# EAGLE design max1k (EAGLE 7.2.0)
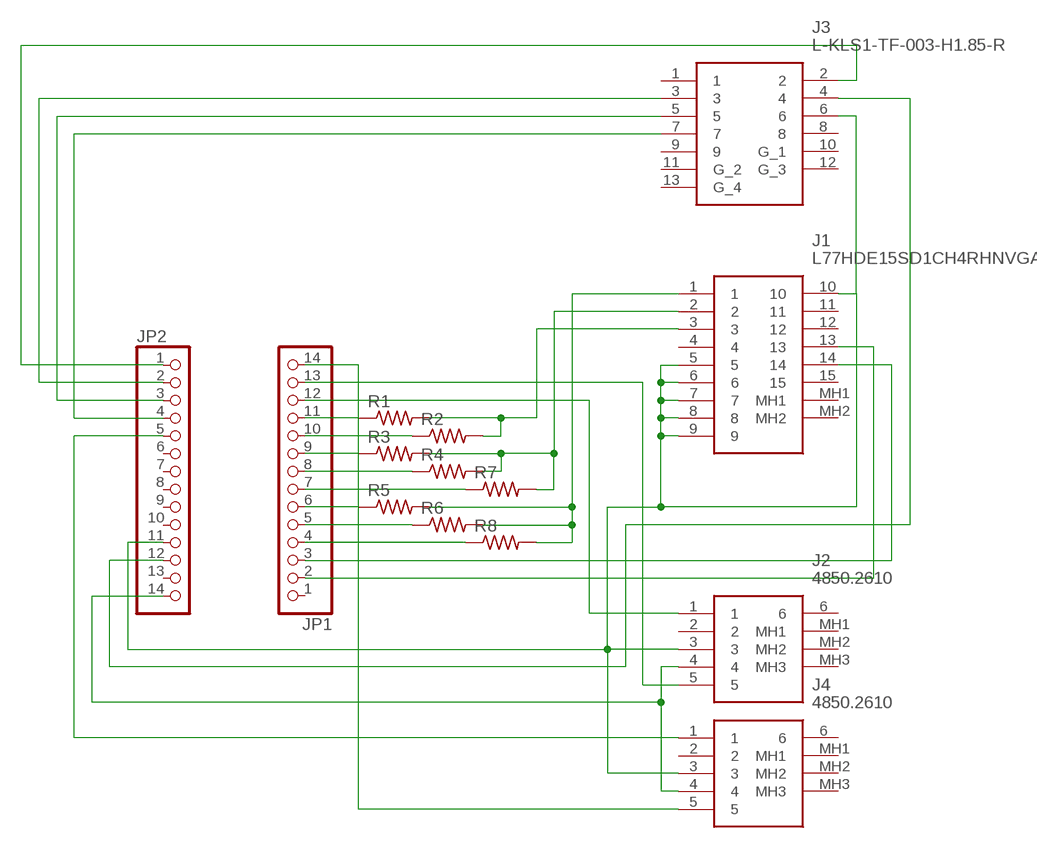
[diagram p0: schematic, sheet 1]

## Parts
J1  L77HDE15SD1CH4RHNVGA  [L77HDE15SD1CH4RHNVGA]
J2  4850.2610  [48502610]
J3  L-KLS1-TF-003-H1.85-R  [L-KLS1-TF-003-H1.85-R]
J4  4850.2610  [48502610]
JP1  PINHD-1X14-CB  [1X14-CB]
JP2  PINHD-1X14-CB  [1X14-CB]
R1  R-US_R0805  [R0805]
R2  R-US_R0805  [R0805]
R3  R-US_R0805  [R0805]
R4  R-US_R0805  [R0805]
R5  R-US_R0805  [R0805]
R6  R-US_R0805  [R0805]
R7  R-US_R0805  [R0805]
R8  R-US_R0805  [R0805]

## Nets
GND: J1.5 J1.6 J1.7 J1.8 J1.9 J1.10 J2.3 J3.6 J4.3 JP2.11
N$1: J1.13 JP1.2
N$2: J1.14 JP1.3
N$3: JP1.11 R1.1
N$4: JP1.10 R2.1
N$5: JP1.9 R3.1
N$6: JP1.8 R4.1
N$7: JP1.7 R7.1
N$8: JP1.6 R5.1
N$9: JP1.5 R6.1
N$10: JP1.4 R8.1
N$11: J1.3 R1.2 R2.2
N$12: J1.2 R3.2 R4.2 R7.2
N$13: J1.1 R5.2 R6.2 R8.2
N$14: J3.4 JP2.12
N$15: J4.5 JP1.14
N$16: J2.1 JP1.12
N$17: J3.5 JP2.3
N$18: J3.3 JP2.2
N$19: J4.1 JP2.5
N$20: J3.7 JP2.4
N$21: J2.5 JP1.13
N$23: J2.4 J4.4 JP2.14
N$24: J3.2 JP2.1
Unconnected: J1.4 J1.11 J1.12 J1.15 J1.MH1 J1.MH2 J2.2 J2.6 J2.MH1 J2.MH2 J2.MH3 J3.1 J3.8 J3.9 J3.10(G_1) J3.11(G_2) J3.12(G_3) J3.13(G_4) J4.2 J4.6 J4.MH1 J4.MH2 J4.MH3 JP1.1 JP2.6 JP2.7 JP2.8 JP2.9 JP2.10 JP2.13

## Library data of the parts
J1 = dsub15_2.00_L77HDE15SD1CH4RHNVGA:L77HDE15SD1CH4RHNVGA: D-Sub High Density Connectors Dsub, Stamped Signal 3A, High Density, Right Angle PCB Thru Hole, FP=8.89mm (.350"), 15 Socket, Bright Tin Shell, Flash Gold, 4-40 Rear Insert, Ground Tab with Boardlock, High Temp, Nickel Shell, VGA Source: Datasheet <https://componentsearchengine.com/Datasheets/1/L77HDE15SD1CH4RHNVGA.pdf>; DESCRIPTION: D-Sub High Density Connectors Dsub, Stamped Signal 3A, High Density, Right Angle PCB Thru Hole, FP=8.89mm (.350"), 15 Socket, Bright Tin Shell, Flash Gold, 4-40 Rear Insert, Ground Tab with Boardlock, High Temp, Nickel Shell, VGA; HEIGHT: 12.55mm; MANUFACTURER_NAME: Amphenol; MANUFACTURER_PART_NUMBER: L77HDE15SD1CH4RHNVGA; MOUSER_PART_NUMBER: 523-7HDE15SDH4RHNVGA; MOUSER_PRICE-STOCK: https://www.mouser.co.uk/ProductDetail/Amphenol-Commercial-Products/L77HDE15SD1CH4RHNVGA?qs=f9yNj16SXrKPVxRw%2FcVQYg%3D%3D
J2 J4 = mini_din_4850.2610:4850.2610: SCHURTER - 4850.2610 - RECEPTACLE, MINI-DIN, PCB, THT, RA, 6WAY Source: Datasheet <http://www.schurterinc.com/bundles/snceschurter/epim/_ProdPool_/newDS/en/typ_4850.2610.pdf>; ALLIED_NUMBER: 70597687; ALLIED_PRICE-STOCK: https://www.alliedelec.com/schurter-4850-2610/70597687/; DESCRIPTION: SCHURTER - 4850.2610 - RECEPTACLE, MINI-DIN, PCB, THT, RA, 6WAY; HEIGHT: 12mm; MANUFACTURER_NAME: SCHURTER; MANUFACTURER_PART_NUMBER: 4850.2610; MOUSER_PART_NUMBER: 693-4850.2610; MOUSER_PRICE-STOCK: https://www.mouser.com/Search/Refine.aspx?Keyword=693-4850.2610
J3 = L-KLS1-TF-003-H1.85-R:L-KLS1-TF-003-H1.85-R: Micro SD Card Connector Source: Datasheet <https://img.ozdisan.com/ETicaret_Dosya/476392_7149645.pdf>; DESCRIPTION: Micro SD Card Connector; HEIGHT: mm; MANUFACTURER_NAME: KLS Electronic; MANUFACTURER_PART_NUMBER: L-KLS1-TF-003-H1.85-R
JP1 JP2 = adafruit:PINHD-1X14: PIN HEADER
R1-R8 = adafruit:R-US_: RESISTOR, American symbol

## Net classes
0 default: width 0.3 mm, drill 0.6 mm, clearance 0.2 mm

## Board
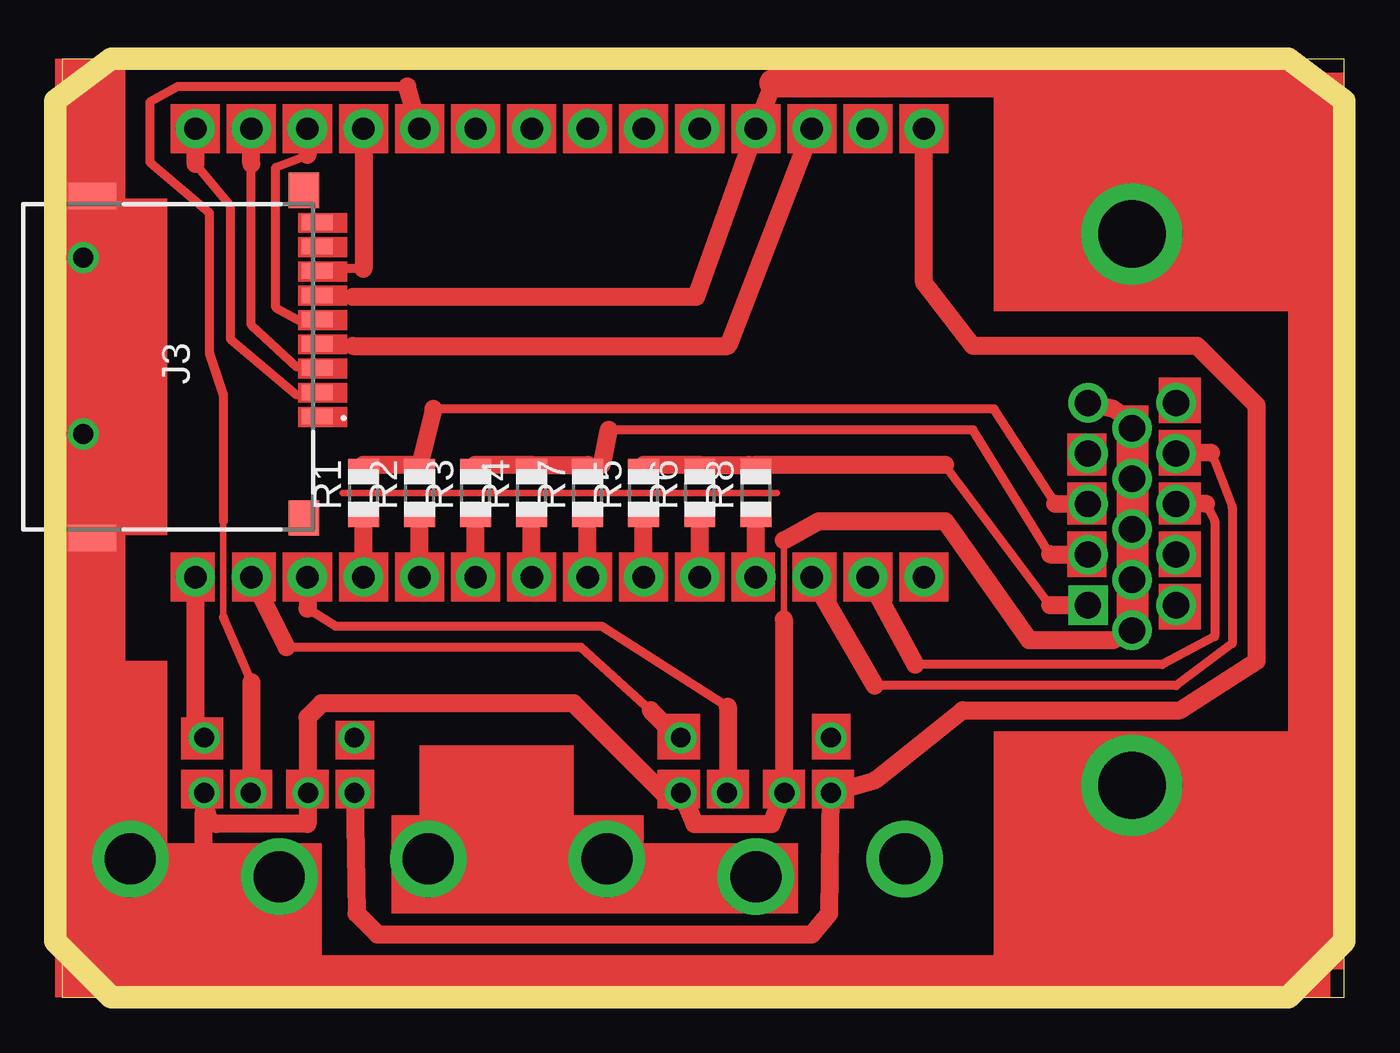
[diagram p1: board, top side]
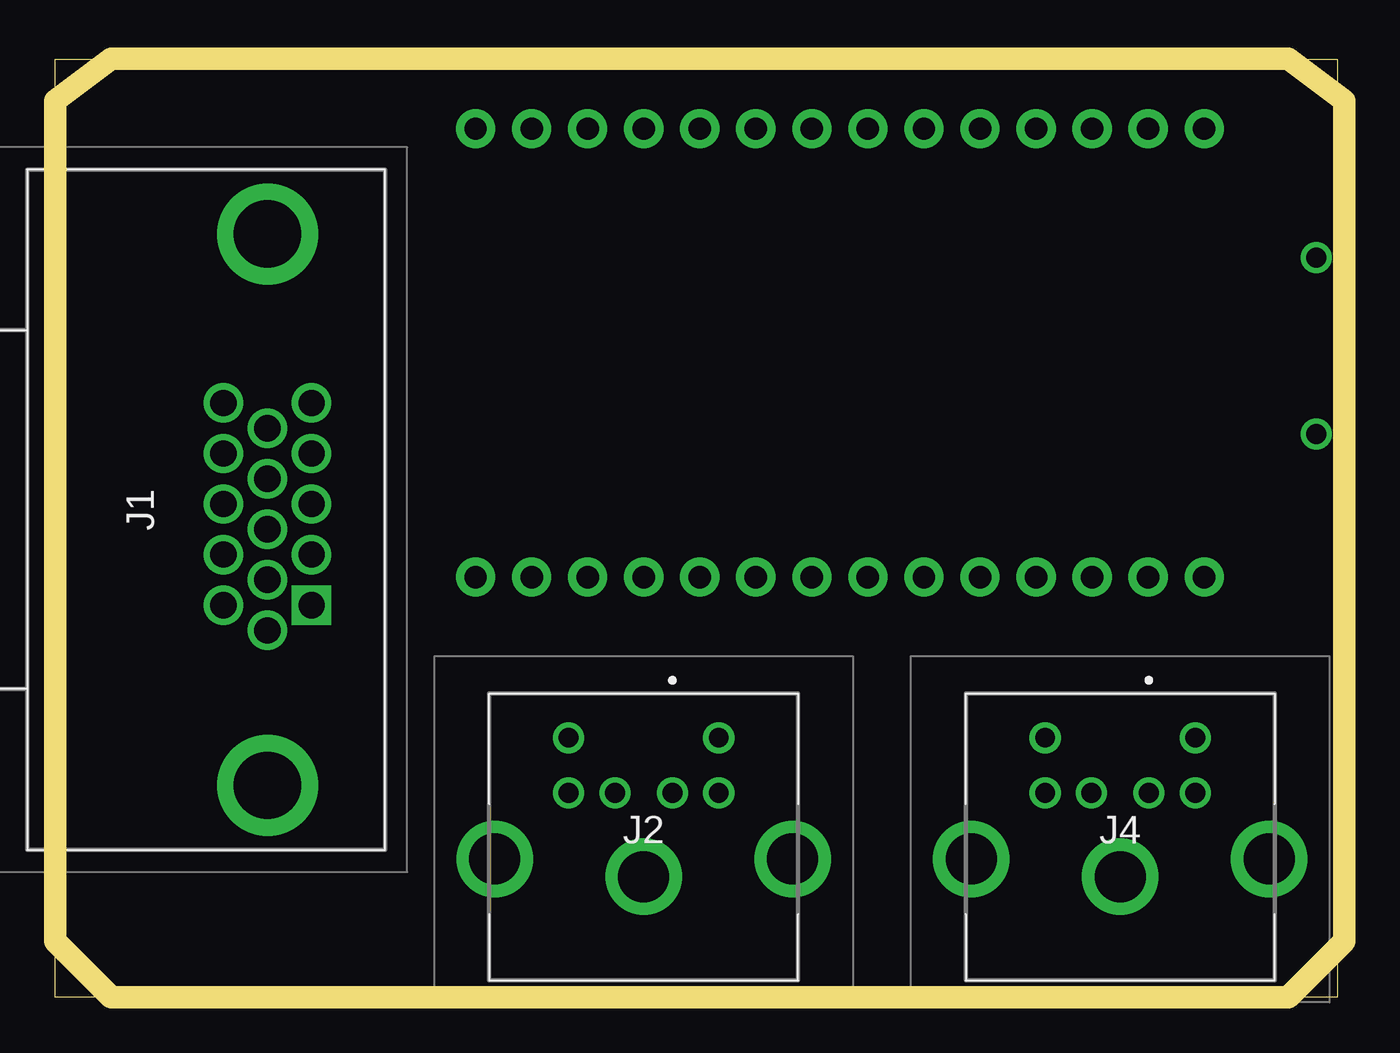
[diagram p2: board, bottom side, seen from below]

Size 58.09 x 42.52 mm. Coordinates in mm from the lower left corner, seen from the top.
Outline: 58.09,0 58.09,42.52 0,42.52 0,0 58.09,0
Copper layers (1*16): Top 0.035mm / dielectric 1.5mm / Bottom 0.035mm
Design rules "default": minimum track width 10mil, minimum drill 24mil, track to track 8mil, track to pad 8mil, pad to pad 8mil, via to via 8mil, smd to smd 8mil, copper to edge 40mil, drill to drill 8mil, minimum pad ring 10mil, minimum via ring 8mil, stop-mask expansion 4mil, vias tented up to drill 0mil, thermal gap 10mil
Milling: 8 lines

### Footprints (pad centres in the part's own frame; a part is rotated, then mirrored left to right if it is on the bottom)
L77HDE15SD1CH4RHNVGA = drill 1.19 pad 1.785 square: 1 0,4 | drill 1.19 pad 1.785: 2 -2.29,4; 3 -4.58,4; 4 -6.87,4; 5 -9.16,4; 6 1.145,2; 7 -1.145,2; 8 -3.435,2; 9 -5.725,2; 10 -8.015,2; 11 0,0; 12 -2.29,0; 13 -4.58,0; 14 -6.87,0; 15 -9.16,0 | drill 3.05 pad 4.575: MH1 8.17,2; MH2 -16.82,2
48502610 = drill 0.9 pad 1.4: 1 1.3,1.65; 2 -1.3,1.65; 3 3.4,1.65; 4 -3.4,1.65; 5 3.4,4.15; 6 -3.4,4.15 | drill 2.309 pad 3.463: MH1 -6.75,-1.35; MH2 6.75,-1.35; MH3 0,-2.15
L-KLS1-TF-003-H1.85-R = smd 0.7 x 1.4: 1 2.25,10.6; 2 1.15,10.6; 3 0.05,10.6; 4 -1.05,10.6; 5 -2.15,10.6; 6 -3.25,10.6; 7 -4.35,10.6; 8 -5.45,10.6; 9 -6.55,10.6 | smd 1.6 x 1.4: 10 -8,10; 13 6.85,10 | smd 1.2 x 2.2: 11 -7.75,0.4; 12 7.75,0.4 | drill 0.9 pad 1.4: 14 3.05,0; 15 -4.95,0
1X14-CB = drill 1.016 pad 1.778: 1 -16.51,0; 2 -13.97,0; 3 -11.43,0; 4 -8.89,0; 5 -6.35,0; 6 -3.81,0; 7 -1.27,0; 8 1.27,0; 9 3.81,0; 10 6.35,0; 11 8.89,0; 12 11.43,0; 13 13.97,0; 14 16.51,0
R0805 = smd 1.1 x 1.4: 1 -1,0; 2 1,0

### Placement (x,y rotation side)
J1  50.47,17.78 270 bottom
J2  31.42,7.62 0 bottom
J3  0.94,28.57 270 top
J4  9.83,7.62 0 bottom
JP1  22.53,19.05 180 top
JP2  22.53,39.37 0 top
R1  13.64,22.86 90 top
R2  16.18,22.86 90 top
R3  18.72,22.86 90 top
R4  21.26,22.86 90 top
R5  26.34,22.86 90 top
R6  28.88,22.86 90 top
R7  23.8,22.86 90 top
R8  31.42,22.86 90 top

### Tracks (layer width: path | path; a pad name or v marks a point on that pad's centre or on a via)
GND
  Top 0.3: 6.97,7.86 6.66,8.89 J4.3 6.02,9.52 | 48.57,17.14 J1.6 | 48.57,18.41 J1.7 48.57,19.05 | 48.57,20.95 J1.8 48.57,21.59 | 48.57,23.5 J1.9 | 46.03,27.3 J1.5
  Top 0.305: 32.69,20.72 32.69,17.14
  Top 0.406: 13.16,31.75 J3.6
  Top 0.813: 6.97,7.86 11.1,7.86 11.1,12.7 11.74,13.34 23.17,13.34 27.61,8.89 J2.3 28.64,7.86 32.13,7.86 32.69,9.21 32.69,17.14 | 48.57,18.41 48.57,17.14 | 48.57,19.05 48.57,20.95 | J1.9 48.57,24.13 48.57,25.4 J1.10 48.57,26.04 47.61,26.67 J1.5 | 48.57,23.5 48.57,21.59 | 32.69,20.72 34.28,21.59 39.99,21.59 43.8,16.19 47.61,16.19 J1.6 | 32.21,41.43 JP2.11 28.72,31.75 13.16,31.75 | 55.39,41.43 57.14,40.01 57.14,3.49 55.23,0.95 6.97,1.27 6.34,2.54 J4.3
  Top 1.27: 32.21,41.43 55.39,41.43
N$1
  Top 0.406: 38.64,15.08 49.84,15.08 52.22,16.35 52.22,21.59 51.82,22.38
  Top 0.813: 38.64,15.08 JP1.2 | 51.82,22.38 J1.13
N$2
  Top 0.406: 36.82,14.13 50.47,14.13 53.01,16.03 53.01,22.23 52.06,24.69
  Top 0.813: 36.82,14.13 JP1.3 | 52.06,24.69 J1.14
N$3
  Top 0.813: JP1.11 R1.1
N$4
  Top 0.813: JP1.10 R2.1
N$5
  Top 0.813: JP1.9 R3.1
N$6
  Top 0.813: JP1.8 R4.1
N$7
  Top 0.813: JP1.7 R7.1
N$8
  Top 0.813: JP1.6 R5.1
N$9
  Top 0.813: JP1.5 R6.1
N$10
  Top 0.813: JP1.4 R8.1
N$11
  Top 0.3: 13.64,24.13 R1.2 | 16.18,24.13 R2.2
  Top 0.406: 16.82,26.67 42.22,26.67 44.99,22.38
  Top 0.813: 13.64,24.13 16.18,24.13 16.82,26.67 | 44.99,22.38 J1.3
N$12
  Top 0.3: 18.72,24.13 R3.2 | 21.26,24.13 R4.2 | 24.44,24.13 23.8,24.13 R7.2
  Top 0.406: 24.75,25.72 41.26,25.72 44.76,20.08
  Top 0.813: 18.72,24.13 21.26,24.13 23.8,24.13 | 24.75,25.72 24.44,24.13 | 44.76,20.08 J1.2
N$13
  Top 0.3: 26.34,24.13 R5.2 | 31.42,24.13 R8.2 31.1,24.13 | 28.88,24.13 R6.2
  Top 0.406: 44.76,17.78 39.99,24.13
  Top 0.813: 26.34,24.13 28.88,24.13 31.1,24.13 31.42,24.13 39.99,24.13 | 44.76,17.78 J1.1
N$14
  Top 0.406: 13.16,29.53 J3.4
  Top 0.813: JP2.12 30.15,29.53 13.16,29.53
N$15
  Top 0.813: JP1.14 6.02,12.07 J4.5
N$16
  Top 0.406: 30.15,13.18 24.44,16.83 12.37,16.83 11.1,17.62
  Top 0.813: 30.15,13.18 30.15,9.84 J2.1 | JP1.12 11.1,17.62
N$17
  Top 0.3: 11.1,30.48 J3.5
  Top 0.406: 11.1,30.48 9.67,31.27 9.67,37.62 11.1,38.18
  Top 0.813: JP2.3 11.1,38.18
N$18
  Top 0.3: 10.62,28.57 11.1,28.57 J3.3
  Top 0.406: 10.62,28.57 8.56,30.48 8.56,37.78
  Top 0.813: 8.56,37.78 JP2.2
N$19
  Top 0.305: 7.29,21.59 7.29,17.22
  Top 0.406: 7.29,17.22 8.56,14.29 | 15.62,41.27 5.23,41.27 3.96,40.56 3.96,37.86 6.66,35.56 6.66,29.21 7.29,27.3 7.29,21.59
  Top 0.813: 8.56,14.29 8.56,10.16 J4.1 | JP2.5 15.62,41.27
N$20
  Top 0.3: 12.37,33.02 11.74,33.02 J3.7
  Top 0.406: 13.64,33.02 12.37,33.02
  Top 0.813: JP2.4 13.64,33.02
N$21
  Top 0.406: 26.66,13.02 23.48,15.88 10.15,15.88
  Top 0.813: 26.66,13.02 27.61,12.07 J2.5 | JP1.13 10.15,15.88
N$22
  Top 0.305: 12.69,22.86 32.37,22.86
N$23
  Top 0.813: J4.4 13.32,3.81 14.28,2.86 33.96,2.86 34.75,3.81 J2.4 36.82,9.84 40.79,13.02 50.63,13.02 54.12,15.24 54.12,26.83 51.42,29.53 41.26,29.53 39.04,32.38 JP2.14
N$24
  Top 0.3: 10.62,27.3 11.1,27.3 J3.2
  Top 0.406: 6.02,37.78 7.61,35.88 7.61,29.84 10.62,27.3
  Top 0.813: JP2.1 6.02,37.78
(copper drawn outside any net)
  shapes: Top area x69